# Altium schematic sheet 00_DesignBlock.SchDoc: ESP-EYE
size 420 x 297 mm; Page Create Date: March  8, 1995; Page Number: 1; Page Size: A3; Comment: espTitleBlock1; Page Count: 1; RevCode: 2.1; DsnPath: D:\GH0050\prj\pcb\Others\esp32\CAM3\ESP-CAM_V28.DSN; SchematicName: SCHEMATIC1; PageName: 00_DesignBlock; PageSize: A3; TopSchematic: True
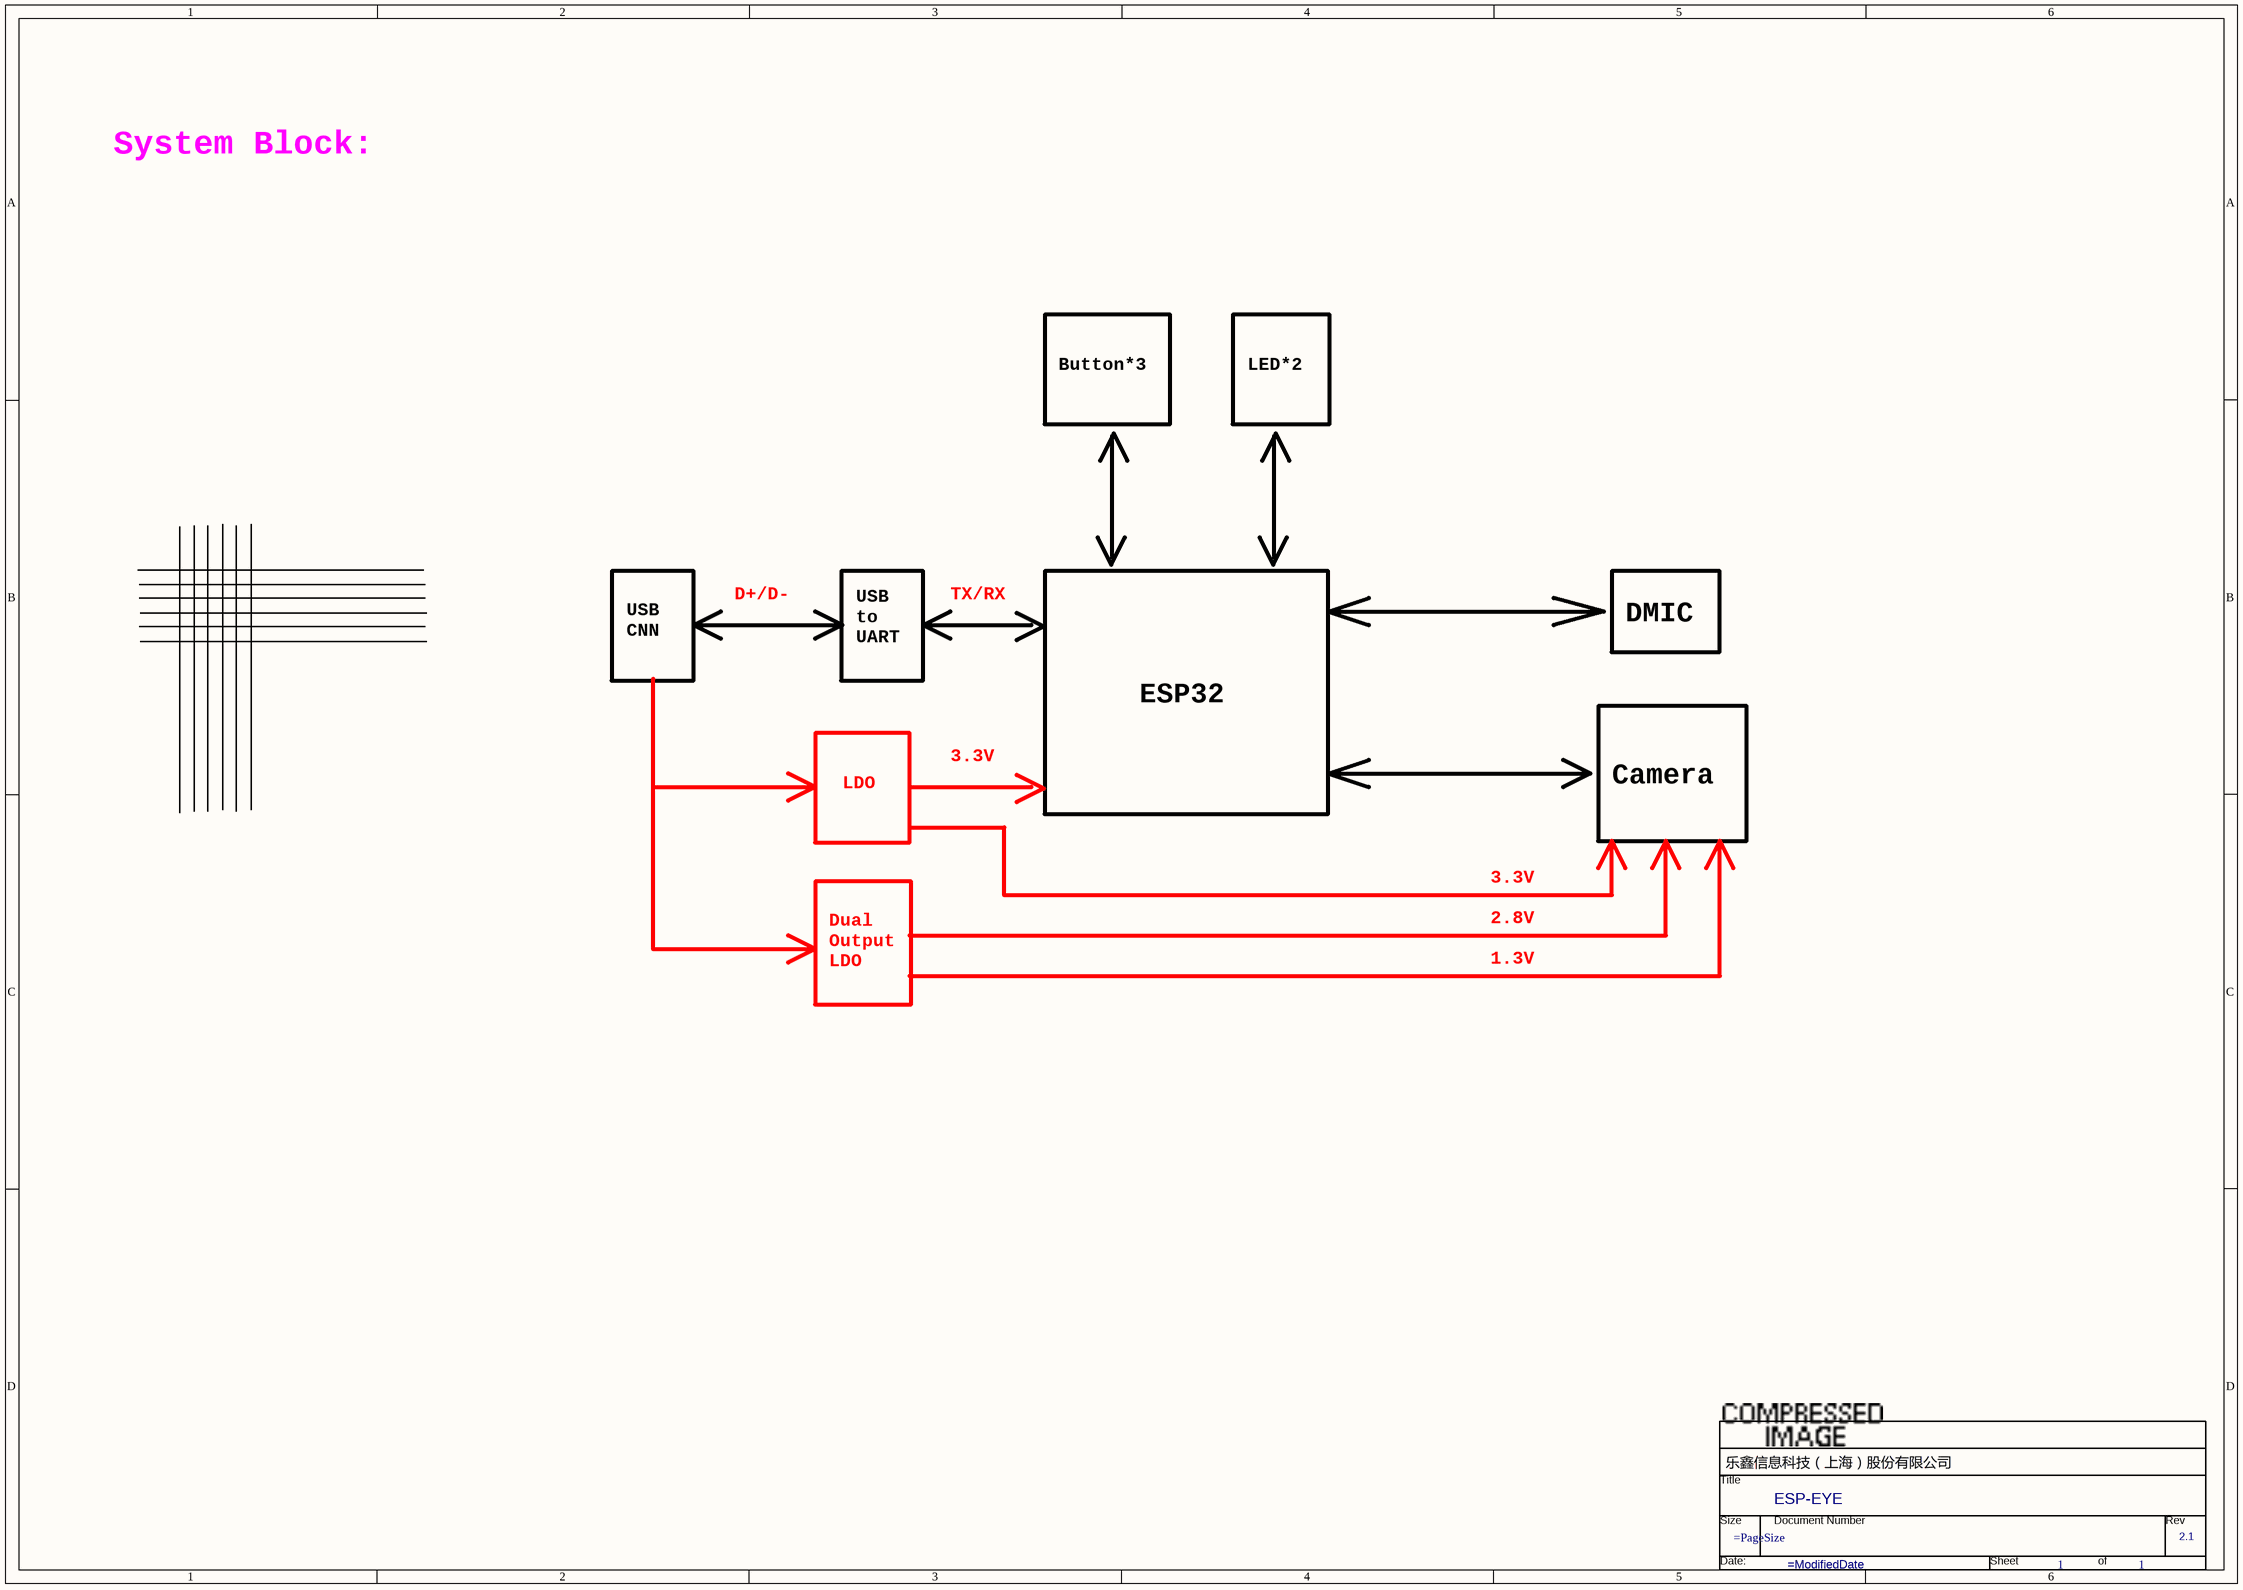
[diagram p0: 00_DesignBlock.SchDoc]

## Parts
*  RevCode: 2.1  Title: ESP-EYE  Page Number: 1  (hidden comment: espTitleBlock1)  (graphical)

## Notes on the sheet
- System Block:
- Button*3
- LED*2
- USB
  CNN
- USB
  to
  UART
- D+/D-
- TX/RX
- DMIC
- ESP32
- LDO
- 3.3V
- Camera
- Dual
  Output
  LDO
- 2.8V
- 1.3V
- (in symbol espTitleBlock1) Title; Size; Document Number; Rev; Date:; Sheet; of

## Library data of the parts
* = espTitleBlock1: Page Create Date: March  8, 1995; Page Size: =PageSize; Page Count: 1; Page Modify Date: =ModifiedDate